# EAGLE design Light Map (EAGLE 6.1)
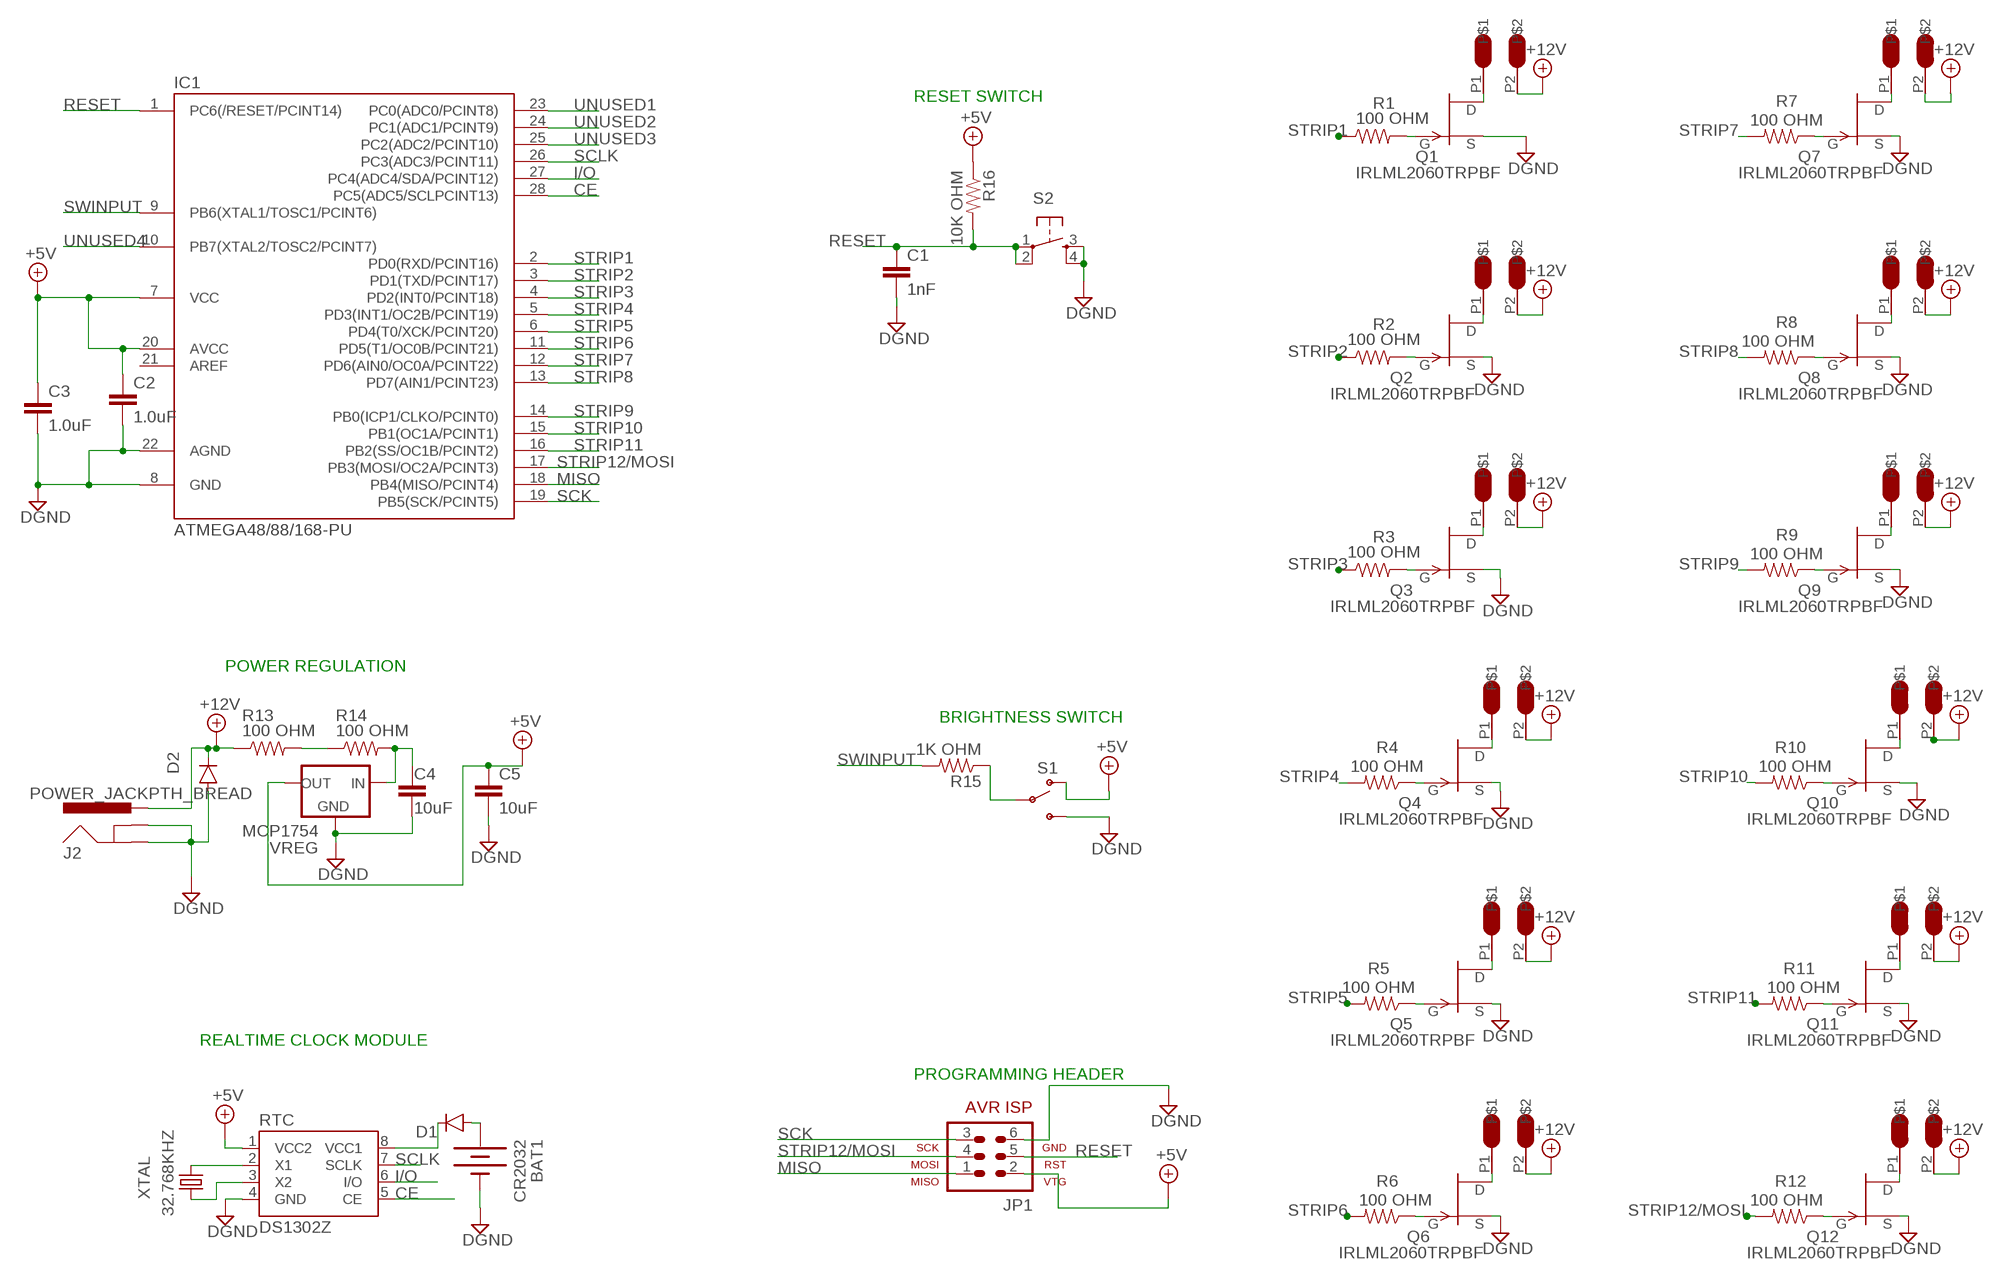
[diagram p0: schematic, sheet 1]

## Parts
BAT1  CR2032  BATTERY20PTH  [BATTCOM_20MM_PTH]
C1  1nF  1.0UF50V10%(1206)  [1206]
C2  1.0uF  1.0UF50V10%(1206)  [1206]
C3  1.0uF  1.0UF50V10%(1206)  [1206]
C4  10uF  10UF-6.3V-20%(1206)  [1206]
C5  10uF  10UF-6.3V-20%(1206)  [1206]
D1  DIODE  [DIODE-1N4001-KIT]
D2  DIODESMA  [SMA-DIODE]
IC1  ATMEGA48/88/168-PU  [DIL28-3]
J2  POWER_JACKPTH_BREAD  [POWER_JACK_PTH_BREAD]
JP1  AVR-ISP-6  [AVR-ISP-6]
Q1  IRLML2060TRPBF  [SOT23]
Q2  IRLML2060TRPBF  [SOT23]
Q3  IRLML2060TRPBF  [SOT23]
Q4  IRLML2060TRPBF  [SOT23]
Q5  IRLML2060TRPBF  [SOT23]
Q6  IRLML2060TRPBF  [SOT23]
Q7  IRLML2060TRPBF  [SOT23]
Q8  IRLML2060TRPBF  [SOT23]
Q9  IRLML2060TRPBF  [SOT23]
Q10  IRLML2060TRPBF  [SOT23]
Q11  IRLML2060TRPBF  [SOT23]
Q12  IRLML2060TRPBF  [SOT23]
R1  100 OHM  RESISTOR1206  [1206]
R2  100 OHM  RESISTOR1206  [1206]
R3  100 OHM  RESISTOR1206  [1206]
R4  100 OHM  RESISTOR1206  [1206]
R5  100 OHM  RESISTOR1206  [1206]
R6  100 OHM  RESISTOR1206  [1206]
R7  100 OHM  RESISTOR1206  [1206]
R8  100 OHM  RESISTOR1206  [1206]
R9  100 OHM  RESISTOR1206  [1206]
R10  100 OHM  RESISTOR1206  [1206]
R11  100 OHM  RESISTOR1206  [1206]
R12  100 OHM  RESISTOR1206  [1206]
R13  100 OHM  RESISTOR1206  [1206]
R14  100 OHM  RESISTOR1206  [1206]
R15  1K OHM  RESISTOR1206  [1206]
R16  10K OHM  RESISTOR1206  [1206]
RTC  DS1302Z  [SO08]
S1  SWITCH-SPDTPTH_LOCK  [SWITCH-SPDT_LOCK.007S]
S2  TAC_SWITCHPTH  [TACTILE-PTH]
U$1  OSTTE020104  [OSTTE020104]
U$2  OSTTE020104  [OSTTE020104]
U$3  OSTTE020104  [OSTTE020104]
U$4  OSTTE020104  [OSTTE020104]
U$5  OSTTE020104  [OSTTE020104]
U$6  OSTTE020104  [OSTTE020104]
U$7  OSTTE020104  [OSTTE020104]
U$8  OSTTE020104  [OSTTE020104]
U$9  OSTTE020104  [OSTTE020104]
U$10  OSTTE020104  [OSTTE020104]
U$11  OSTTE020104  [OSTTE020104]
U$12  OSTTE020104  [OSTTE020104]
VREG  MCP1754  [SOT23]
XTAL  32.768KHZ  CRYTALTC26H  [TC26H]

## Nets
+5V: C2.1 C3.1 C5.1 IC1.7(VCC) IC1.20(AVCC) JP1.2 R16.1 RTC.1(VCC2) S1.1(O) VREG.2(OUT)
+12V: D2.C J2.PWR R13.1 U$1.P2 U$2.P2 U$3.P2 U$4.P2 U$5.P2 U$6.P2 U$7.P2 U$8.P2 U$9.P2 U$10.P2 U$11.P2 U$12.P2
CE: IC1.28(PC5(ADC5/SCLPCINT13)) RTC.5(CE)
DGND: BAT1.2(-) C1.2 C2.2 C3.2 C4.2 C5.2 D2.A IC1.8(GND) IC1.22(AGND) J2.GND J2.GNDBREAK JP1.6 Q1.2(S) Q2.2(S) Q3.2(S) Q4.2(S) Q5.2(S) Q6.2(S) Q7.2(S) Q8.2(S) Q9.2(S) Q10.2(S) Q11.2(S) Q12.2(S) RTC.4(GND) S1.3(S) S2.3 S2.4 VREG.1(GND)
I/O: IC1.27(PC4(ADC4/SDA/PCINT12)) RTC.6(I/O)
MISO: IC1.18(PB4(MISO/PCINT4)) JP1.1
N$1: D1.C RTC.8(VCC1)
N$2: BAT1.1(+) D1.A
N$3: C4.1 R14.2 VREG.3(IN)
N$6: Q1.1(G) R1.2
N$7: Q2.1(G) R2.2
N$8: Q3.1(G) R3.2
N$9: Q4.1(G) R4.1
N$10: Q5.1(G) R5.1
N$11: Q10.1(G) R10.1
N$14: Q6.1(G) R6.1
N$15: Q7.1(G) R7.1
N$16: Q8.1(G) R8.1
N$17: Q9.1(G) R9.1
N$18: Q11.1(G) R11.1
N$20: Q1.3(D) U$1.P1
N$21: Q2.3(D) U$5.P1
N$22: Q3.3(D) U$4.P1
N$23: Q4.3(D) U$3.P1
N$24: Q5.3(D) U$2.P1
N$26: Q6.3(D) U$6.P1
N$27: Q7.3(D) U$7.P1
N$28: Q8.3(D) U$8.P1
N$29: Q9.3(D) U$9.P1
N$30: Q10.3(D) U$10.P1
N$31: Q11.3(D) U$11.P1
N$32: Q12.3(D) U$12.P1
N$45: Q12.1(G) R12.1
N$47: R13.2 R14.1
N$49: R15.1 S1.2(P)
RESET: C1.1 IC1.1(PC6(/RESET/PCINT14)) JP1.5 R16.2 S2.1 S2.2
SCK: IC1.19(PB5(SCK/PCINT5)) JP1.3
SCLK: IC1.26(PC3(ADC3/PCINT11)) RTC.7(SCLK)
STRIP1: IC1.2(PD0(RXD/PCINT16)) R1.1
STRIP2: IC1.3(PD1(TXD/PCINT17)) R2.1
STRIP3: IC1.4(PD2(INT0/PCINT18)) R3.1
STRIP4: IC1.5(PD3(INT1/OC2B/PCINT19)) R4.2
STRIP5: IC1.6(PD4(T0/XCK/PCINT20)) R5.2
STRIP6: IC1.11(PD5(T1/OC0B/PCINT21)) R6.2
STRIP7: IC1.12(PD6(AIN0/OC0A/PCINT22)) R7.2
STRIP8: IC1.13(PD7(AIN1/PCINT23)) R8.2
STRIP9: IC1.14(PB0(ICP1/CLKO/PCINT0)) R9.2
STRIP10: IC1.15(PB1(OC1A/PCINT1)) R10.2
STRIP11: IC1.16(PB2(SS/OC1B/PCINT2)) R11.2
STRIP12/MOSI: IC1.17(PB3(MOSI/OC2A/PCINT3)) JP1.4 R12.2
SWINPUT: IC1.9(PB6(XTAL1/TOSC1/PCINT6)) R15.2
UNUSED1: IC1.23(PC0(ADC0/PCINT8))
UNUSED2: IC1.24(PC1(ADC1/PCINT9))
UNUSED3: IC1.25(PC2(ADC2/PCINT10))
UNUSED4: IC1.10(PB7(XTAL2/TOSC2/PCINT7))
XTAL1: RTC.3(X2) XTAL.1
XTAL2: RTC.2(X1) XTAL.2
Unconnected: IC1.21(AREF)

## Notes on the sheet
- RESET SWITCH
- POWER REGULATION
- BRIGHTNESS SWITCH
- REALTIME CLOCK MODULE
- PROGRAMMING HEADER

## Library data of the parts
BAT1 = SparkFun:BATTERY: Battery Holders Various common sizes : AA, AAA, 20mm coin cell and 12mm coin cell.
C1 = SparkFun-Capacitors:1.0UF50V10%(1206): CAP-09822; PROD_ID: CAP-09822; VALUE: 1.0uF
C2 C3 = SparkFun-Capacitors:1.0UF50V10%(1206): CAP-09822; PROD_ID: CAP-09822
C4 C5 = SparkFun-Capacitors:10UF-6.3V-20%(1206): CAP-10057 Ceramic; PROD_ID: CAP-10057
D1 D2 = SparkFun-DiscreteSemi:DIODE: Diode These are standard reverse protection diodes and small signal diodes. SMA package can handle up to about 1A. SOD-323 can handle about 200mA. What the SOD-323 package when ordering, there are some mfgs out there that are 5-pin packages.
IC1 = atmega8:ATMEGA48/88/168-PU
J2 = SparkFun-Connectors:POWER_JACK: Power Jack This is the standard 5.5mm barrel jack for power. The PTH is the most common, proven, reliable, footprint. The Slot footprint only works if the mill layer is transmitted to the PCB fab house so be warned. Mating wall wart : TOL-00298 (and others); PROD_ID: PRT-10811
JP1 = atmel:AVR-ISP-6: AVR ISP-6 Serial Programming Header
Q1-Q12 = Aidan:IRLML2060TRPBF: N-Channel Junction FET
R1-R16 = SparkFun-Passives:RESISTOR: Resistor Basic schematic elements and footprints for 0603, 1206, and PTH resistors.
RTC = Aidan:DS1302Z
S1 = SparkFun-Electromechanical:SWITCH-SPDT: SPDT Switch Simple slide switch, Spark Fun Electronics SKU : COM-00102 DPDT SMT slide switch, AYZ0202, SWCH-08179
S2 = SparkFun-Electromechanical:TAC_SWITCH: Momentary Switch Button commonly used for reset or general input. Spark Fun Electronics SKU : COM-00097 SMT- SWCH-08247
U$1-U$12 = Aidan:OSTTE020104: TERMINAL BLOCK 3.5MM 2POS PCB
VREG = Aidan:MCP1754
XTAL = crystal:CRYTAL: CRYSTAL

## Board
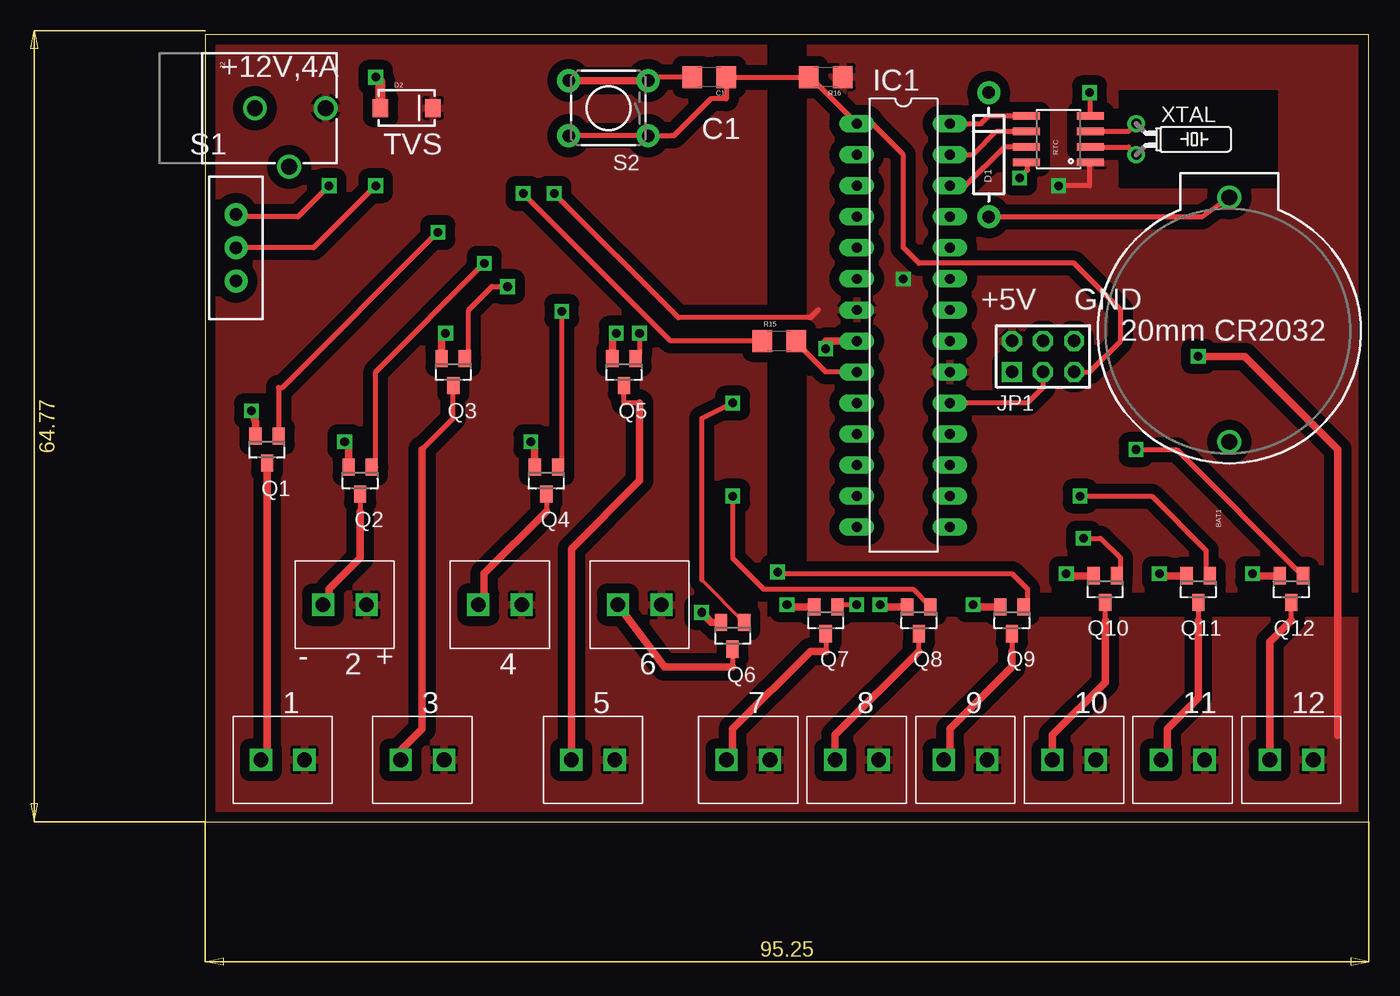
[diagram p1: board, top side]
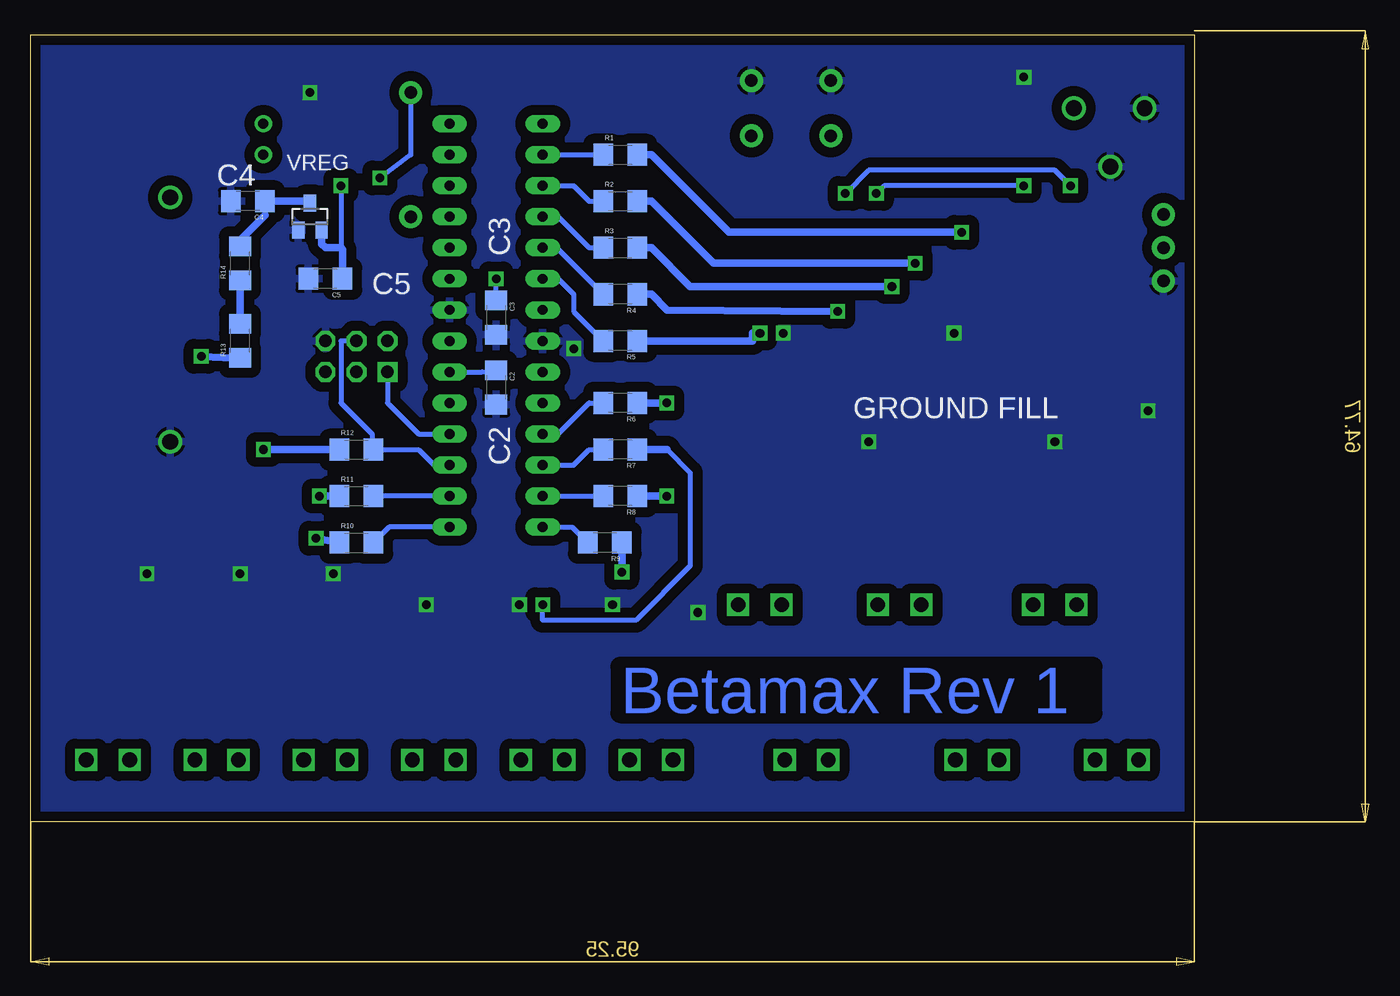
[diagram p2: board, bottom side, seen from below]

Size 95.23 x 64.44 mm. Coordinates in mm from the lower left corner, seen from the top.
Outline: 0,0 95.23,0 95.23,64.44 0,64.44 0,0
Copper layers (1*16): Top 0.035mm / dielectric 1.5mm / Bottom 0.035mm
Design rules: minimum track width 8mil, minimum drill 20mil, track to track 8mil, track to pad 8mil, pad to pad 8mil, via to via 8mil, smd to smd 8mil, copper to edge 10mil, drill to drill 8mil, minimum pad ring 12mil, minimum via ring 10mil, stop-mask expansion 4mil, vias tented up to drill 25mil, thermal gap 10mil

### Footprints (pad centres in the part's own frame; a part is rotated, then mirrored left to right if it is on the bottom)
BATTCOM_20MM_PTH = drill 1.3: 1 20,0; 2 0,0
1206 = smd 1.6 x 1.8: 1 -1.4,0; 2 1.4,0
DIODE-1N4001-KIT = drill 1.016 pad 1.88: A -5.08,0; C 5.08,0
SMA-DIODE = smd 1.27 x 1.47: A -2.15,0; C 2.15,0
DIL28-3 = drill 0.813 long: 1 -16.51,-3.81; 2 -13.97,-3.81; 3 -11.43,-3.81; 4 -8.89,-3.81; 5 -6.35,-3.81; 6 -3.81,-3.81; 7 -1.27,-3.81; 8 1.27,-3.81; 9 3.81,-3.81; 10 6.35,-3.81; 11 8.89,-3.81; 12 11.43,-3.81; 13 13.97,-3.81; 14 16.51,-3.81; 15 16.51,3.81; 16 13.97,3.81; 17 11.43,3.81; 18 8.89,3.81; 19 6.35,3.81; 20 3.81,3.81; 21 1.27,3.81; 22 -1.27,3.81; 23 -3.81,3.81; 24 -6.35,3.81; 25 -8.89,3.81; 26 -11.43,3.81; 27 -13.97,3.81; 28 -16.51,3.81
POWER_JACK_PTH_BREAD = drill 1.3: GND 0,7.9; GNDBREAK 4.8,10.7; PWR 0,13.7
AVR-ISP-6 = drill 1.016 square: 1 -2.54,-1.27 | drill 1.016 octagon: 2 -2.54,1.27; 3 0,-1.27; 4 0,1.27; 5 2.54,-1.27; 6 2.54,1.27
SOT23 = smd 1 x 1.4: 1 -0.95,-1.1; 2 0.95,-1.1; 3 0,1.1
SO08 = smd 0.61 x 2.21: 1 -1.905,-2.616; 2 -0.635,-2.616; 3 0.635,-2.616; 4 1.905,-2.616; 5 1.905,2.616; 6 0.635,2.616; 7 -0.635,2.616; 8 -1.905,2.616
SWITCH-SPDT_LOCK.007S = drill 1.016 pad 1.88: 1 0,2.718; 2 0,0; 3 0,-2.718
TACTILE-PTH = drill 1.016 pad 1.88: 1 -3.251,2.261; 2 3.251,2.261; 3 -3.251,-2.261; 4 3.251,-2.261
OSTTE020104 = drill 1.2 square: P1 -1.77,0; P2 1.79,0
TC26H = drill 0.813: 1 -1.27,0; 2 1.27,0

### Placement (x,y rotation side)
BAT1  83.82,31.11 90 top
C1  41.27,60.96 180 top
C2  57.15,35.56 270 bottom
C3  57.15,41.27 270 bottom
C4  77.47,50.8 180 bottom
C5  71.12,44.45 180 bottom
D1  64.14,54.61 90 top
D2  16.51,58.42 0 top
IC1  57.15,40.64 270 top
J2  -3.81,58.42 270 top
JP1  68.58,38.1 0 top
Q1  5.08,30.48 180 top
Q2  12.7,27.94 180 top
Q3  20.32,36.83 180 top
Q4  27.94,27.94 180 top
Q5  34.29,36.83 180 top
Q6  43.18,15.24 180 top
Q7  50.8,16.51 180 top
Q8  58.42,16.51 180 top
Q9  66.04,16.51 180 top
Q10  73.66,19.05 180 top
Q11  81.28,19.05 180 top
Q12  88.9,19.05 180 top
R1  46.99,54.61 0 bottom
R2  46.99,50.8 0 bottom
R3  46.99,46.99 0 bottom
R4  46.99,43.18 180 bottom
R5  46.99,39.37 180 bottom
R6  46.99,34.29 180 bottom
R7  46.99,30.48 180 bottom
R8  46.99,26.67 180 bottom
R9  48.26,22.86 180 bottom
R10  68.58,22.86 0 bottom
R11  68.58,26.67 0 bottom
R12  68.58,30.48 0 bottom
R13  78.11,39.37 90 bottom
R14  78.11,45.72 90 bottom
R15  46.99,39.37 0 top
R16  50.8,60.96 180 top
RTC  69.85,55.88 90 top
S1  2.54,46.99 0 top
S2  33.02,58.42 180 top
U$1  6.35,5.08 0 top
U$2  31.75,5.08 0 top
U$3  24.13,17.78 0 top
U$4  17.78,5.08 0 top
U$5  11.43,17.78 0 top
U$6  35.56,17.78 0 top
U$7  44.45,5.08 0 top
U$8  53.34,5.08 0 top
U$9  62.23,5.08 0 top
U$10  71.12,5.08 0 top
U$11  80.01,5.08 0 top
U$12  88.9,5.08 0 top
VREG  72.39,49.53 0 bottom
XTAL  76.2,55.88 270 top

### Tracks (layer width: path | path; a pad name or v marks a point on that pad's centre or on a via)
+5V  (via drill 0.7)
  Top 0.406: 50.16,41.91 49.53,41.27 38.73,41.27 v28.57,51.43 | v10.16,52.07 7.62,49.53 2.72,49.53 S1.1 | RTC.1 72.39,53.97 72.39,52.07 v69.85,52.07
  Bottom 0.406: v69.85,52.07 69.85,46.99 | v10.16,52.07 11.43,53.34 26.67,53.34 v28.57,51.43 | IC1.20 58.29,36.83 C2.1 | C3.1 v57.15,44.45
  Bottom 0.61: VREG.2 71.44,47.31 71.12,46.99 69.85,46.99 69.72,46.86 C5.1
  pour Top (isolate 0.813, rank 2): 49.53,64.77 49.53,19.05 95.25,19.05 95.25,64.77
+12V  (via drill 0.7)
  Top 0.61: v81.28,38.1 85.09,38.1 92.71,30.48 92.71,7.1
  Bottom 0.406: R13.1 78.61,37.97
  Bottom 0.61: 78.61,37.97 v81.28,38.1
  pour Top (isolate 0.813): 0,64.77 0,0 95.25,0 95.25,16.51 45.72,16.51 45.72,64.77
CE
  Top 0.406: 67.31,57.78 RTC.5 64.14,57.78 63.5,57.15 IC1.28
DGND  (via drill 0.7)
  Top 0.406: RTC.4 72.47,59.61 v72.39,59.69 | C1.2 36.55,60.96 S2.3
  Top 0.61: v50.8,38.73 50.8,39.37 IC1.8 | S2.4 S2.3 | Q1.2 4.13,32.7 v3.81,33.66 | Q2.2 11.75,30.79 v11.43,31.11 | Q3.2 19.37,39.69 v19.69,40 | Q4.2 26.99,30.79 v26.67,31.11 | Q5.2 33.34,39.69 v33.66,40 | Q6.2 41.45,16.34 v40.64,17.14 | Q7.2 47.8,17.61 v47.62,17.78 | Q8.2 55.41,17.61 v55.24,17.78 | Q9.2 63.04,17.61 v62.87,17.78 | Q10.2 70.66,20.15 v70.48,20.32 | Q11.2 78.28,20.15 v78.11,20.32 | Q12.2 85.9,20.15 v85.73,20.32
  Top 0.813: D2.A 14.36,60.57 v13.97,60.96
  pour Bottom (isolate 0.813): 0,64.77 0,0 95.25,0 95.25,64.77
I/O
  Top 0.406: RTC.6 64.77,56.52 62.87,54.61 IC1.27
MISO
  Bottom 0.406: JP1.1 66.04,34.29 63.5,31.75 IC1.18
MT
  cutout Top: 74.93,59.69 74.93,52.07 87.63,52.07 87.63,59.69
N$1  (via drill 0.7)
  Top 0.406: v66.68,52.7 67.31,53.34 67.31,53.9 RTC.8
  Bottom 0.406: D1.C 64.14,54.61 v66.68,52.7
N$2
  Top 0.406: D1.A 81.6,49.53 BAT1.1
N$3
  Bottom 0.406: R14.2 78.11,47.62 | C4.1 76.07,49.66 | 72.56,50.8 VREG.3
  Bottom 0.61: 78.11,47.62 76.07,49.66 | C4.1 72.56,50.8
N$6  (via drill 0.7 pad 0.3)
  Top 0.406: v19.05,48.26 6.35,35.56 6.03,35.56 Q1.1
  Bottom 0.61: v19.05,48.26 38.1,48.26 44.45,54.61 R1.2
N$7  (via drill 0.7)
  Top 0.406: v22.86,45.72 13.97,36.83 13.97,29.04 Q2.1
  Bottom 0.61: v22.86,45.72 39.37,45.72 44.45,50.8 R2.2
N$8  (via drill 0.7)
  Top 0.406: v24.77,43.81 23.49,43.81 21.59,41.91 21.59,37.93 Q3.1
  Bottom 0.61: v24.77,43.81 41.27,43.81 44.45,46.99 R3.2
N$9  (via drill 0.7)
  Top 0.406: v29.21,41.78 29.21,40.64 29.21,29.04 Q4.1
  Top 0.61: 29.21,41.91 v29.21,41.78
  Bottom 0.61: v29.21,41.78 43.18,41.91 44.45,43.18 R4.1
N$10  (via drill 0.7)
  Top 0.406: v35.56,40 35.56,38.25 Q5.1
  Bottom 0.61: v35.56,40 36.2,40 36.2,39.37 R5.1
N$11  (via drill 0.7)
  Top 0.406: v71.89,23.22 73.3,23.22 74.93,21.59 74.93,20.32 74.76,20.15 Q10.1
  Bottom 0.61: R10.1 v71.89,23.22
N$14  (via drill 0.7)
  Top 0.305: 40.64,19.83 Q6.1
  Top 0.406: v43.18,34.29 40.64,33.02 40.64,19.83
  Bottom 0.61: R6.1 v43.18,34.29
N$15  (via drill 0.7)
  Top 0.406: v53.34,17.78 51.92,17.78 Q7.1
  Bottom 0.406: 43.18,30.48 41.27,28.57 41.27,20.96 45.72,16.51 53.34,16.51 v53.34,17.78
  Bottom 0.61: R7.1 43.18,30.48
N$16  (via drill 0.7)
  Top 0.406: v43.18,26.67 43.18,21.59 45.72,19.05 57.93,19.05 Q8.1
  Bottom 0.61: R8.1 v43.18,26.67
N$17  (via drill 0.7)
  Top 0.406: 46.99,20.32 62.23,20.32 66.04,20.32 67.31,19.05 67.31,17.93 Q9.1
  Top 0.61: v46.86,20.45 46.99,20.32
  Bottom 0.61: R9.1 v46.86,20.45
N$18  (via drill 0.7)
  Top 0.406: v71.61,26.67 77.47,26.67 81.92,22.22 81.92,20.46 Q11.1
  Bottom 0.61: R11.1 v71.61,26.67
  Bottom 0.813: R11.1 69.85,26.67
N$20
  Top 0.406: Q1.3 5.08,29.21
  Top 0.61: U$1.P1 5.08,5.58 5.08,29.21
N$21
  Top 0.406: Q2.3 12.7,25.4
  Top 0.61: 12.7,25.4 12.7,21.59 10.16,19.05 10.16,18.28 U$5.P1
N$22
  Top 0.406: 17.78,30.48 20.32,33.02 Q3.3
  Top 0.61: U$4.P1 16.01,5.85 17.78,7.62 17.78,30.48
N$23
  Top 0.406: Q4.3 27.94,25.4
  Top 0.61: 27.94,25.4 22.86,20.32 22.86,18.28 U$3.P1
N$24
  Top 0.406: 35.56,34.29 34.29,34.29 Q5.3
  Top 0.61: U$2.P1 29.98,22.36 35.56,27.94 35.56,34.29
N$26
  Top 0.406: Q6.3 43.18,12.7
  Top 0.61: 43.18,12.7 37.6,12.7 U$6.P1
N$27
  Top 0.406: Q7.3 50.8,13.97
  Top 0.61: 50.8,13.97 49.53,13.97 43.18,7.62 43.18,5.58 U$7.P1
N$28
  Top 0.406: 58.42,13.97 Q8.3
  Top 0.61: U$8.P1 51.57,7.12 58.42,13.97
N$29
  Top 0.406: Q9.3 66.04,13.97
  Top 0.61: 66.04,13.97 66.04,12.7 60.96,7.62 60.96,5.58 U$9.P1
N$30
  Top 0.406: 73.66,16.51 Q10.3
  Top 0.61: U$10.P1 69.35,7.12 73.66,11.43 73.66,16.51
N$31
  Top 0.406: Q11.3 81.28,16.51
  Top 0.61: 81.28,16.51 81.28,10.16 78.74,7.62 78.74,5.58 U$11.P1
N$32
  Top 0.406: 88.9,16.51 Q12.3
  Top 0.61: U$12.P1 87.13,14.74 88.9,16.51
N$45  (via drill 0.7)
  Top 0.406: v76.2,30.48 79.52,30.48 Q12.1
  Bottom 0.61: R12.1 v76.2,30.48
N$47
  Bottom 0.406: R13.2 78.11,41.27
  Bottom 0.61: R14.1 78.11,41.27
N$49  (via drill 0.7)
  Top 0.406: R15.1 38.1,39.37 v26.03,51.43 | v13.97,52.07 8.89,46.99 S1.2
  Bottom 0.406: v13.97,52.07 25.4,52.07 v26.03,51.43
RESET
  Top 0.406: JP1.5 72.39,36.83 74.93,39.37 74.93,41.91 71.12,45.72 58.42,45.72 57.15,46.99 57.15,54.61 54.61,57.15 IC1.1 49.53,60.96 R16.2 C1.1 42.67,59.18 41.41,59.18 38.38,56.16 38.1,56.16 S2.1 S2.2
SCK
  Top 0.406: JP1.3 68.58,35.56 67.31,34.29 IC1.19
SCLK
  Top 0.406: RTC.7 65.41,55.24 62.23,52.07 IC1.26
STRIP1
  Bottom 0.406: IC1.2 R1.1
STRIP2
  Bottom 0.406: R2.1 49.53,50.8 50.8,52.07 IC1.3
STRIP3
  Bottom 0.406: R3.1 49.53,46.99 52.07,49.53 IC1.4
STRIP4
  Bottom 0.406: R4.2 52.2,46.99 IC1.5
STRIP5
  Bottom 0.406: R5.2 50.8,41.78 50.8,43.18 52.07,44.45 IC1.6
STRIP6
  Bottom 0.406: R6.2 49.53,34.29 52.07,31.75 IC1.11
STRIP7
  Bottom 0.406: R7.2 49.53,30.48 50.8,29.21 IC1.12
STRIP8
  Bottom 0.406: IC1.13 R8.2
STRIP9
  Bottom 0.406: R9.2 50.93,24.13 IC1.14
STRIP10
  Bottom 0.406: IC1.15 65.91,24.13 R10.2
STRIP11
  Bottom 0.406: IC1.16 R11.2
STRIP12/MOSI
  Bottom 0.406: JP1.4 69.85,39.37 69.85,34.29 67.31,31.75 67.31,30.61 R12.2 63.5,30.48 62.23,29.21 IC1.17
SWINPUT
  Top 0.406: R15.2 48.39,39.24 50.8,36.83 IC1.9
XTAL1
  Top 0.406: RTC.3 75.57,56.52 XTAL.1
XTAL2
  Top 0.406: RTC.2 75.57,55.24 XTAL.2

### Text on the board
Bottom: Betamax Rev 1
tPlace: +12V,4A | C1 | TVS | +5V | GND | 20mm CR2032 | - | 2 | + | 4 | 6 | 1 | 3 | 5 | 7 | 8 | 9 | 10 | 11 | 12
bPlace: C4 | C3 | C5 | GROUND FILL | C2